# Altium project PCB Issues.PrjPcb
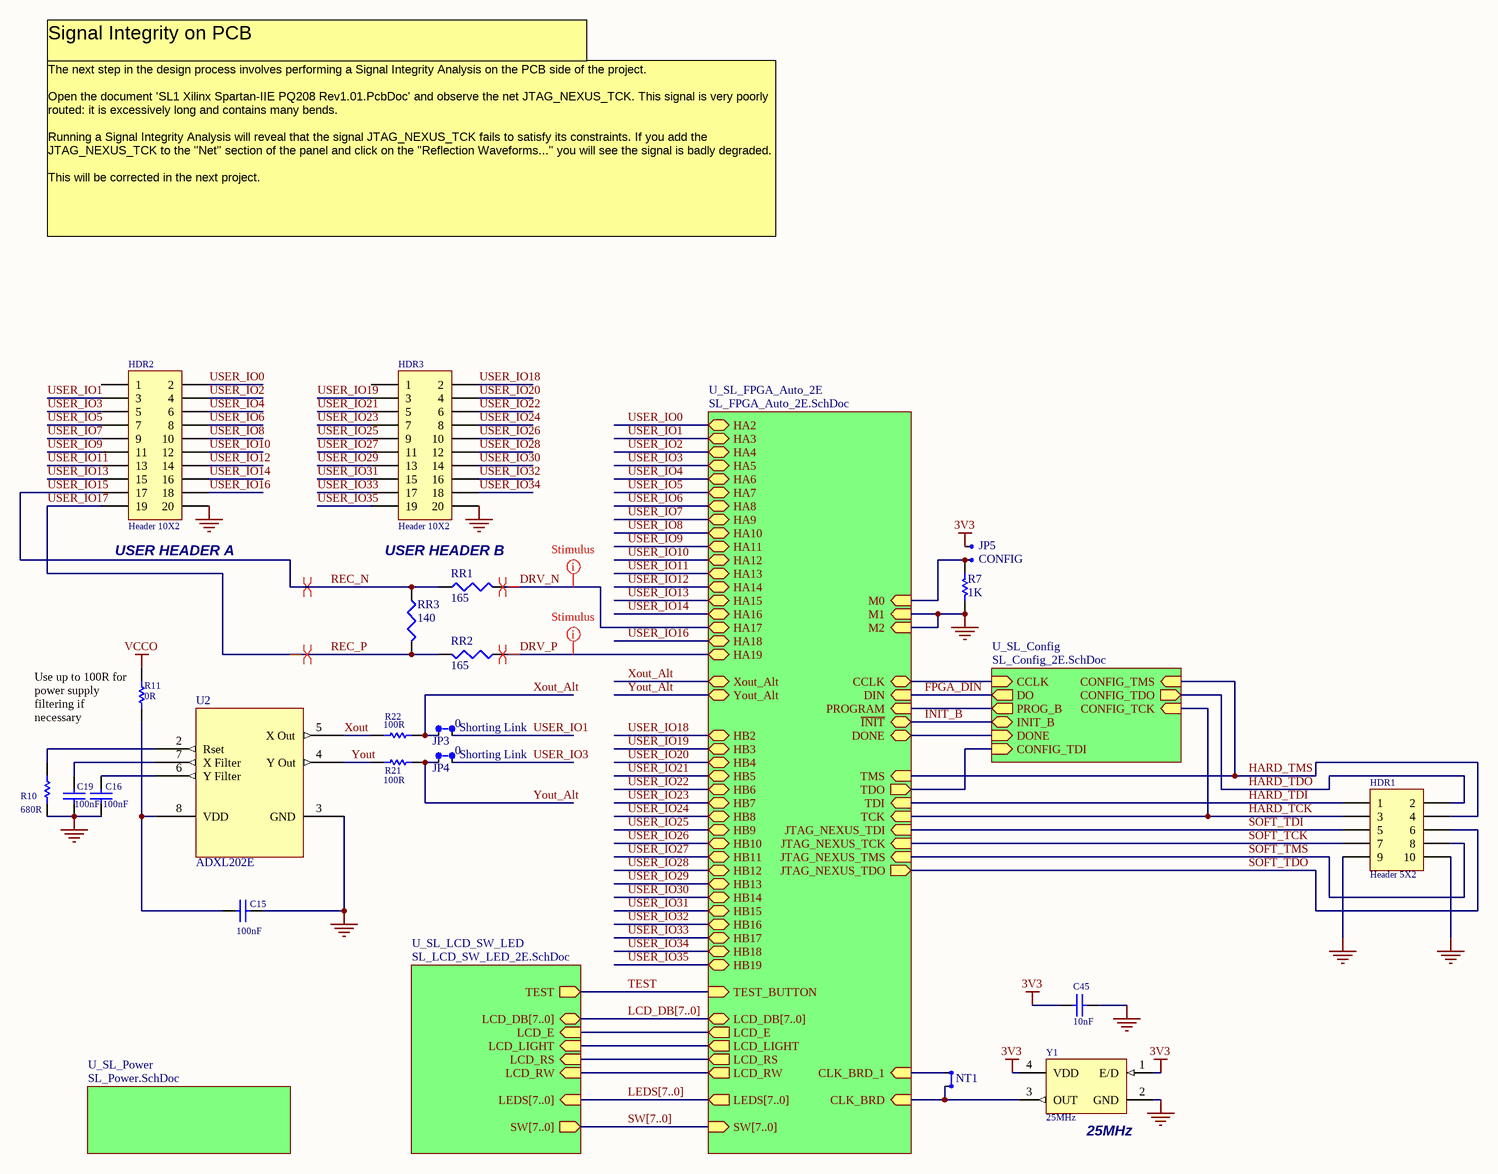
[diagram p0: SL1 Xilinx Spartan-IIE PQ208 Rev1.01.SchDoc]
3 sheets, 91 parts. Net scope: hierarchical (ports join the sheet entries above them; power ports are global).
Board file: SL1 Xilinx Spartan-IIE PQ208 Rev1.01.PcbDoc
Sheets:
  SL1 Xilinx Spartan-IIE PQ208 Rev1.01.SchDoc
    U_SL_Config = SL_Config_2E.SchDoc
    U_SL_Power = SL_Power.SchDoc

## Sheet SL1 Xilinx Spartan-IIE PQ208 Rev1.01.SchDoc: Spirit Level - Spartan 2E
size A3; Organization: Altium Limited; Address1: L3, 12a Rodborough Rd; Address2: Frenchs Forest; Address3: NSW; Address4: Australia 2086; DocumentNumber: 5; SheetNumber: 5; SheetTotal: 5

### Parts
C15  100nF  [CC1608-0603]
C16  100nF  [CC1608-0603]
C19  100nF  [CC1608-0603]
C45  10nF  [CC1608-0603]
HDR1  Header 5X2  [HDR2X5_LP]
HDR2  Header 10X2  [HDR2X10]
HDR3  Header 10X2  [HDR2X10]
JP3  X axis  [HDR1X2]  (value not drawn)
JP4  Y axis  [HDR1X2]  (value not drawn)
JP5  CONFIG  [HDR1X2]
JS2  Shorting Link  value 0  (mechanical)
JS3  Shorting Link  value 0  (mechanical)
NT1  *  [NT]  (value not drawn)  (net tie, no BOM)
R7  1K  [CR2012-0805]
R10  680R  [CR2012-0805]
R11  0R  [CR2012-0805]
R21  100R  [CR2012-0805]
R22  100R  [CR2012-0805]
RR1  value 165  [AXIAL-0.3]  (hidden comment: Comment)
RR2  value 165  [AXIAL-0.3]  (hidden comment: Comment)
RR3  value 140  [AXIAL-0.3]  (hidden comment: Comment)
U2  ADXL202E  [E-8]
Y1  25MHz  [QSMO_4200]

### Sub-sheets
U_SL_Config = SL_Config_2E.SchDoc: PROG_B (out), CONFIG_TDO (out), DO (out), CCLK (in), CONFIG_TDI (in), CONFIG_TCK (in), CONFIG_TMS (in), INIT_B (bidir), DONE (in)
U_SL_FPGA_Auto_2E = SL_FPGA_Auto_2E.SchDoc (file not in this document): CLK_BRD (in), HA10 (bidir), HA11 (bidir), HA12 (bidir), HA13 (bidir), HA14 (bidir), HA15 (bidir), HA16 (bidir), HA17 (bidir), HA18 (bidir), HA19 (bidir), HA2 (bidir), HA3 (bidir), HA4 (bidir), HA5 (bidir), HA6 (bidir), HA7 (bidir), HA8 (bidir), HA9 (bidir), HB10 (bidir), HB11 (bidir), HB12 (bidir), HB13 (bidir), HB14 (bidir), HB15 (bidir), HB16 (bidir), HB17 (bidir), HB18 (bidir), HB19 (bidir), HB2 (bidir), HB3 (bidir), HB4 (bidir), HB5 (bidir), HB6 (bidir), HB7 (bidir), HB8 (bidir), HB9 (bidir), JTAG_NEXUS_TCK (in), JTAG_NEXUS_TDI (in), JTAG_NEXUS_TDO (out), JTAG_NEXUS_TMS (in), LCD_DB[7..0] (bidir), LCD_E (out), LCD_LIGHT (out), LCD_RS (out), LCD_RW (out), LEDS[7..0] (out), SW[7..0] (in), TEST_BUTTON (in), CCLK (bidir), DONE (bidir), M0 (in), M1 (in), M2 (in), PROGRAM (in), TCK (in), TDI (in), TDO (out), TMS (in), DIN (in), ~{INIT} (bidir), CLK_BRD_1 (in), Xout_Alt, Yout_Alt
U_SL_LCD_SW_LED = SL_LCD_SW_LED_2E.SchDoc (file not in this document): TEST (out), SW[7..0] (out), LCD_DB[7..0] (bidir), LCD_E (in), LCD_RS (in), LCD_RW (in), LCD_LIGHT (in), LEDS[7..0] (in)
U_SL_Power = SL_Power.SchDoc: no entries

### Nets
3V3: C45.1 JP5.2 R11.1 Y1.1(E/D) Y1.4(VDD)  [also labelled VCCO]
GND: C15.2 C16.2 C19.2 C45.2 HDR1.9 HDR1.10 HDR2.20 HDR3.20 R7.1 R10.1 U2.3(GND) Y1.2(GND) ; sheet U_SL_FPGA_Auto_2E/M1, sheet U_SL_FPGA_Auto_2E/M2
CCLK: sheet U_SL_Config/CCLK, sheet U_SL_FPGA_Auto_2E/CCLK
DONE: sheet U_SL_Config/DONE, sheet U_SL_FPGA_Auto_2E/DONE
DRV_N: RR1.1 ; sheet U_SL_FPGA_Auto_2E/HA17
DRV_P: RR2.2 ; sheet U_SL_FPGA_Auto_2E/HA19
FPGA_DIN: sheet U_SL_Config/DO, sheet U_SL_FPGA_Auto_2E/DIN  [project net DO]
HARD_TCK: HDR1.3 ; sheet U_SL_Config/CONFIG_TCK, sheet U_SL_FPGA_Auto_2E/TCK
HARD_TDI: HDR1.1 ; sheet U_SL_FPGA_Auto_2E/TDI
HARD_TDO: HDR1.2 ; sheet U_SL_Config/CONFIG_TDO
HARD_TMS: HDR1.4 ; sheet U_SL_Config/CONFIG_TMS, sheet U_SL_FPGA_Auto_2E/TMS
INIT_B: sheet U_SL_Config/INIT_B, sheet U_SL_FPGA_Auto_2E/~{INIT}
PROG_B: sheet U_SL_Config/PROG_B, sheet U_SL_FPGA_Auto_2E/PROGRAM
REC_N: HDR2.17 RR1.2 RR3.2  [also labelled USER_IO15]
REC_P: HDR2.19 RR2.1 RR3.1  [also labelled USER_IO17]
SOFT_TCK: HDR1.7 ; sheet U_SL_FPGA_Auto_2E/JTAG_NEXUS_TCK
SOFT_TDI: HDR1.5 ; sheet U_SL_FPGA_Auto_2E/JTAG_NEXUS_TDI
SOFT_TDO: HDR1.6 ; sheet U_SL_FPGA_Auto_2E/JTAG_NEXUS_TDO
SOFT_TMS: HDR1.8 ; sheet U_SL_FPGA_Auto_2E/JTAG_NEXUS_TMS
TDI_C: sheet U_SL_Config/CONFIG_TDI, sheet U_SL_FPGA_Auto_2E/TDO
TEST: sheet U_SL_LCD_SW_LED/TEST, sheet U_SL_FPGA_Auto_2E/TEST_BUTTON
USER_IO0: HDR2.2 ; sheet U_SL_FPGA_Auto_2E/HA2
USER_IO1: HDR2.3 JP3.2 ; sheet U_SL_FPGA_Auto_2E/HA3
USER_IO2: HDR2.4 ; sheet U_SL_FPGA_Auto_2E/HA4
USER_IO3: HDR2.5 JP4.2 ; sheet U_SL_FPGA_Auto_2E/HA5
USER_IO4: HDR2.6 ; sheet U_SL_FPGA_Auto_2E/HA6
USER_IO5: HDR2.7 ; sheet U_SL_FPGA_Auto_2E/HA7
USER_IO6: HDR2.8 ; sheet U_SL_FPGA_Auto_2E/HA8
USER_IO7: HDR2.9 ; sheet U_SL_FPGA_Auto_2E/HA9
USER_IO8: HDR2.10 ; sheet U_SL_FPGA_Auto_2E/HA10
USER_IO9: HDR2.11 ; sheet U_SL_FPGA_Auto_2E/HA11
USER_IO10: HDR2.12 ; sheet U_SL_FPGA_Auto_2E/HA12
USER_IO11: HDR2.13 ; sheet U_SL_FPGA_Auto_2E/HA13
USER_IO12: HDR2.14 ; sheet U_SL_FPGA_Auto_2E/HA14
USER_IO13: HDR2.15 ; sheet U_SL_FPGA_Auto_2E/HA15
USER_IO14: HDR2.16 ; sheet U_SL_FPGA_Auto_2E/HA16
USER_IO16: HDR2.18 ; sheet U_SL_FPGA_Auto_2E/HA18
USER_IO18: HDR3.2 ; sheet U_SL_FPGA_Auto_2E/HB2
USER_IO19: HDR3.3 ; sheet U_SL_FPGA_Auto_2E/HB3
USER_IO20: HDR3.4 ; sheet U_SL_FPGA_Auto_2E/HB4
USER_IO21: HDR3.5 ; sheet U_SL_FPGA_Auto_2E/HB5
USER_IO22: HDR3.6 ; sheet U_SL_FPGA_Auto_2E/HB6
USER_IO23: HDR3.7 ; sheet U_SL_FPGA_Auto_2E/HB7
USER_IO24: HDR3.8 ; sheet U_SL_FPGA_Auto_2E/HB8
USER_IO25: HDR3.9 ; sheet U_SL_FPGA_Auto_2E/HB9
USER_IO26: HDR3.10 ; sheet U_SL_FPGA_Auto_2E/HB10
USER_IO27: HDR3.11 ; sheet U_SL_FPGA_Auto_2E/HB11
USER_IO28: HDR3.12 ; sheet U_SL_FPGA_Auto_2E/HB12
USER_IO29: HDR3.13 ; sheet U_SL_FPGA_Auto_2E/HB13
USER_IO30: HDR3.14 ; sheet U_SL_FPGA_Auto_2E/HB14
USER_IO31: HDR3.15 ; sheet U_SL_FPGA_Auto_2E/HB15
USER_IO32: HDR3.16 ; sheet U_SL_FPGA_Auto_2E/HB16
USER_IO33: HDR3.17 ; sheet U_SL_FPGA_Auto_2E/HB17
USER_IO34: HDR3.18 ; sheet U_SL_FPGA_Auto_2E/HB18
USER_IO35: HDR3.19 ; sheet U_SL_FPGA_Auto_2E/HB19
Xout: R22.2 U2.5(X_Out)
Xout_Alt: JP3.1 R22.1 ; sheet U_SL_FPGA_Auto_2E/Xout_Alt
Yout: R21.2 U2.4(Y_Out)
Yout_Alt: JP4.1 R21.1 ; sheet U_SL_FPGA_Auto_2E/Yout_Alt
NetC15_1: C15.1 R11.2 U2.8(VDD)
NetC16_1: C16.1 U2.6(Y_Filter)
NetC19_1: C19.1 U2.7(X_Filter)
NetJP5_1: JP5.1 R7.2 ; sheet U_SL_FPGA_Auto_2E/M0
NetNT1_1: NT1.1 ; sheet U_SL_FPGA_Auto_2E/CLK_BRD_1
NetNT1_2: NT1.2 Y1.3(OUT) ; sheet U_SL_FPGA_Auto_2E/CLK_BRD
NetR10_2: R10.2 U2.2(Rset)
(unnamed): sheet U_SL_LCD_SW_LED/LCD_E, sheet U_SL_FPGA_Auto_2E/LCD_E
(unnamed): sheet U_SL_LCD_SW_LED/LCD_RS, sheet U_SL_FPGA_Auto_2E/LCD_RS
(unnamed): sheet U_SL_LCD_SW_LED/LCD_RW, sheet U_SL_FPGA_Auto_2E/LCD_RW
(unnamed): sheet U_SL_LCD_SW_LED/LCD_LIGHT, sheet U_SL_FPGA_Auto_2E/LCD_LIGHT

Not connected (* = marked no-connect by the designer): HDR2 1; HDR3 1; U2 1(Self_Test)

### Buses and harness runs
bus LCD_DB[7..0] = sheet U_SL_FPGA_Auto_2E/LCD_DB[7..0] = sheet U_SL_LCD_SW_LED/LCD_DB[7..0]
bus LEDS[7..0] = sheet U_SL_FPGA_Auto_2E/LEDS[7..0] = sheet U_SL_LCD_SW_LED/LEDS[7..0]
bus SW[7..0] = sheet U_SL_FPGA_Auto_2E/SW[7..0] = sheet U_SL_LCD_SW_LED/SW[7..0]

### Layout directives
differential pair: DRV_N, DRV_P, REC_N, REC_P
rule Signal Stimulus [Kind - Single Pulse    Level - High    Start Time = 10.00n    Stop Time = 60.00n    Period Time = 100.0n]: DRV_N
rule Signal Stimulus [Kind - Single Pulse    Level - Low    Start Time = 10.00n    Stop Time = 60.00n    Period Time = 100.0n]: DRV_P

### Notes on the sheet
- Signal Integrity on PCB
- The next step in the design process involves performing a Signal Integrity Analysis on the PCB side of the project.
  Open the document 'SL1 Xilinx Spartan-IIE PQ208 Rev1.01.PcbDoc' and observe the net JTAG_NEXUS_TCK. This signal is very poorly routed: it is excessively long and contains many bends.
  Running a Signal Integrity Analysis will reveal that the signal JTAG_NEXUS_TCK fails to satisfy its constraints. If you add the JTAG_NEXUS_TCK to the "Net" section of the panel and click on the "Reflection Waveforms..." you will see the signal is badly degraded.
  This will be corrected in the next project.
- (near HDR2) USER HEADER A
- USER HEADER B
- (near R11) Use up to 100R for power supply filtering if necessary
- (near Y1) 25MHz
- Title
- Size:
- Date:
- A3
- Number:
- Time:
- Revision:
- Sheet
- of
- File:

### Library data of the parts
C15 C16 C19 = CAP: Capacitor; AEMS Code: 2101550
C45 = CAP: Capacitor; AEMS Code: 2100341
HDR1 = Header 5X2: Header, 5-Pin, Dual row; Revision: 17-Jul-2002: Re-released for DXP Platform.
HDR2 HDR3 = Header 10X2: Header, 10-Pin, Dual row; Revision: July-2002: Re-released for DXP Platform.
JP3-JP5 NT1 = Jumper, 2-Pin
JS2 JS3 = Jumper Socket: Shorting Link, 2.54mm (0.1") Pitch
R7 = RES: Resistor; AEMS Code: 1200008JN
R10 = Res1: Resistor; AEMS Code: CHANGED VALUE; Revision: July-2002: Re-released for DXP Platform.
R11 = RES: Resistor; AEMS Code: 1200075
R21 R22 = Res1: Resistor; AEMS Code: 1200012JT; Revision: July-2002: Re-released for DXP Platform.
RR1-RR3 = Res3: Resistor; Published: 8-Jun-2000; LatestRevisionDate: 04-Mar-2005; LatestRevisionNote: PCB Footprint replaced.; PackageReference: J1-0603; Publisher: Altium Limited
U2 = ADXL202E: Accelerometer with Digital Output
Y1 = QSMO_4200: Surface Mount Crystal Oscillator

## Sheet SL_Config_2E.SchDoc: FPGA Configuration
size A; Organization: Altium Limited; Address1: L3, 12a Rodborough Rd; Address2: Frenchs Forest; Address3: NSW; Address4: Australia 2086; DocumentNumber: 2; SheetNumber: 2; SheetTotal: 5
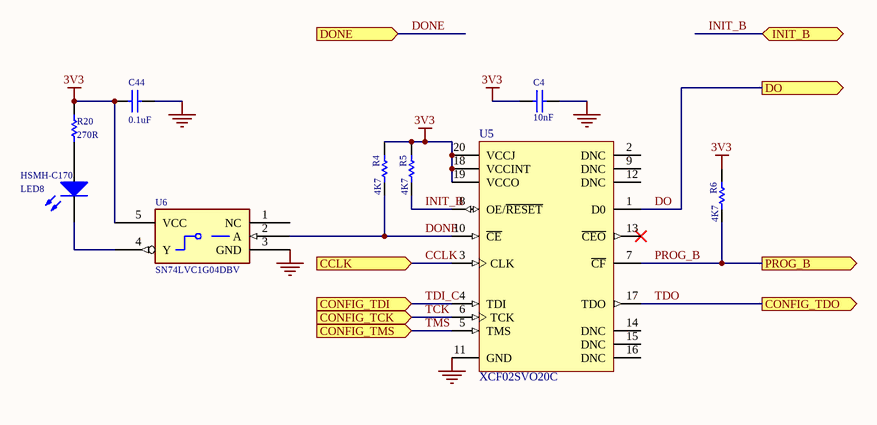
[diagram p1: SL_Config_2E.SchDoc]

### Parts
C4  10nF  [CC1608-0603]
C44  0.1uF  [CC2012-0805]
LED8  HSMH-C170  [SMD _LED]
R4  4K7  [CR2012-0805]
R5  4K7  [CR2012-0805]
R6  4K7  [CR2012-0805]
R20  270R  [CR2012-0805]
U5  XCF02SVO20C  [VO20]
U6  SN74LVC1G04DBV  [SO-G5/P.95]

### Ports
CCLK (in), CONFIG_TCK (in), CONFIG_TDI (in), CONFIG_TDO (out), CONFIG_TMS (in), DO (out), DONE (in), INIT_B (bidir), PROG_B (out)

### Nets
3V3: C4.1 C44.2 R4.1 R5.1 R6.1 R20.2 U5.18(VCCINT) U5.19(VCCO) U5.20(VCCJ) U6.5(VCC)
GND: C4.2 C44.1 U5.11(GND) U6.3(GND)
CCLK: U5.3(CLK) ; port CCLK
DO: U5.1(D0) ; port DO
DONE: R4.2 U5.10(~{CE}) U6.2(A) ; port DONE
INIT_B: R5.2 U5.8(OE/~{RESET}) ; port INIT_B
PROG_B: R6.2 U5.7(~{CF}) ; port PROG_B
TCK: U5.6(TCK) ; port CONFIG_TCK  [project net HARD_TCK]
TDI_C: U5.4(TDI) ; port CONFIG_TDI
TDO: U5.17(TDO) ; port CONFIG_TDO  [project net HARD_TDO]
TMS: U5.5(TMS) ; port CONFIG_TMS  [project net HARD_TMS]
NetLED8_1: LED8.1(A) R20.1
NetLED8_2: LED8.2(K) U6.4(Y)

Not connected (* = marked no-connect by the designer): U5 2(DNC) 9(DNC) 12(DNC) 13(~{CEO})* 14(DNC) 15(DNC) 16(DNC); U6 1(NC)

### Notes on the sheet
- Title
- Size:
- Date:
- A
- Number:
- Time:
- Revision:
- Sheet
- of
- File:

### Library data of the parts
C4 = CAP: Capacitor; AEMS Code: 2100341
C44 = CAP: Capacitor; Supplier: FARNELL; Supplier Code: 317-287
LED8 = HSMX-C670: Typical RED GaAs SMD LED Agilent make; AEMS Code: 2610081; Revision: July-2002: Re-released for DXP Platform.
R4-R6 = RES: Resistor; AEMS Code: 1200226
R20 = RES: Resistor; AEMS Code: 1200430
U5 = XCF02SVO20C: XCF00S Series, Platform Flash In-System Programmable Configuration 3.3V PROM, 20-Pin TSOP, 2-Megabit, Commercial Grade; PackageDocument: ver1.0, May-2003; AEMS Code: CHANGED VALUE; DatasheetDocument: ver2.3, May-2004; PackageReference: VO20; Code_JEDEC: MO-153-AC
U6 = SN74AHC1G04DBVR: Manufacturer: TI

## Sheet SL_Power.SchDoc: Power Supply
size B; Organization: Altium Limited; Address1: L3, 12a Rodborough Rd; Address2: Frenchs Forest; Address3: NSW; Address4: Australia 2086; DocumentNumber: 4; SheetNumber: 4; SheetTotal: 5
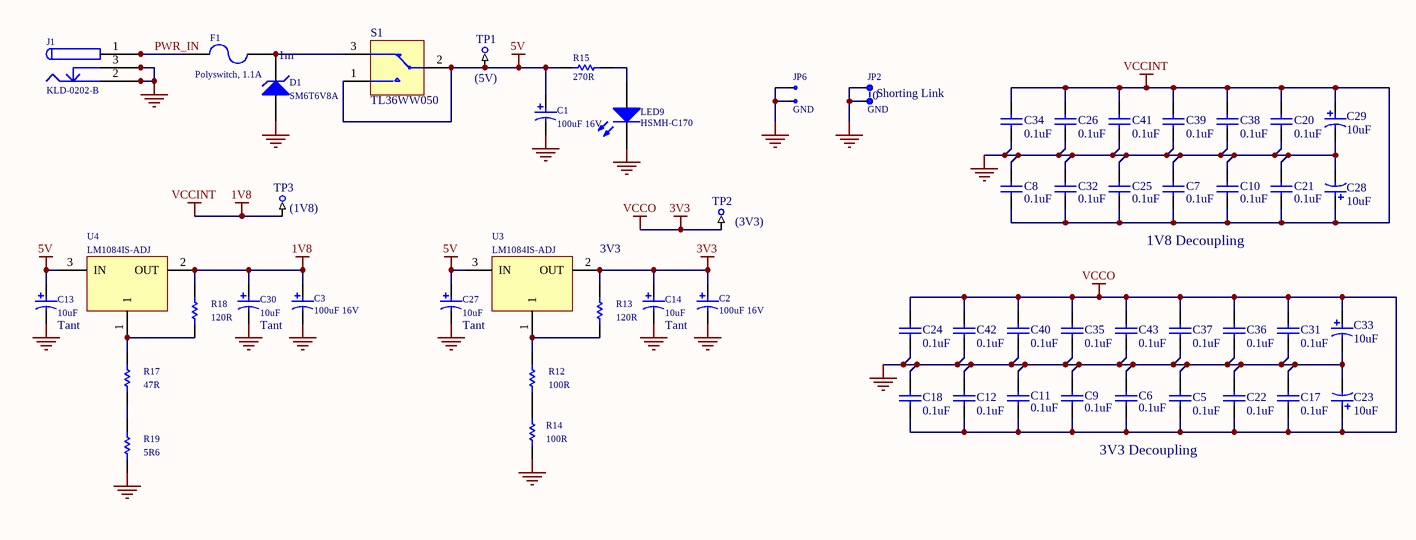
[diagram p2: SL_Power.SchDoc]

### Parts
C1  100uF 16V  [CAPPR2-5x6.8]
C2  100uF 16V  [CAPPR2-5x6.8]
C3  100uF 16V  [CAPPR2-5x6.8]
C5  0.1uF  [CC2012-0805]
C6  0.1uF  [CC2012-0805]
C7  0.1uF  [CC2012-0805]
C8  0.1uF  [CC2012-0805]
C9  0.1uF  [CC2012-0805]
C10  0.1uF  [CC2012-0805]
C11  0.1uF  [CC2012-0805]
C12  0.1uF  [CC2012-0805]
C13  10uF  Capacitor Type: Tant  [MCCT-B]
C14  10uF  Capacitor Type: Tant  [MCCT-B]
C17  0.1uF  [CC2012-0805]
C18  0.1uF  [CC2012-0805]
C20  0.1uF  [CC2012-0805]
C21  0.1uF  [CC2012-0805]
C22  0.1uF  [CC2012-0805]
C23  10uF  [MCCT-B]
C24  0.1uF  [CC2012-0805]
C25  0.1uF  [CC2012-0805]
C26  0.1uF  [CC2012-0805]
C27  10uF  Capacitor Type: Tant  [MCCT-B]
C28  10uF  [MCCT-B]
C29  10uF  [MCCT-B]
C30  10uF  Capacitor Type: Tant  [MCCT-B]
C31  0.1uF  [CC2012-0805]
C32  0.1uF  [CC2012-0805]
C33  10uF  [MCCT-B]
C34  0.1uF  [CC2012-0805]
C35  0.1uF  [CC2012-0805]
C36  0.1uF  [CC2012-0805]
C37  0.1uF  [CC2012-0805]
C38  0.1uF  [CC2012-0805]
C39  0.1uF  [CC2012-0805]
C40  0.1uF  [CC2012-0805]
C41  0.1uF  [CC2012-0805]
C42  0.1uF  [CC2012-0805]
C43  0.1uF  [CC2012-0805]
D1  SM6T6V8A  [DO214]
F1  Polyswitch, 1.1A  value 1m  [RUE160_0.2]
J1  KLD-0202-B  [KLD-0202]
JP2  GND  [HDR1X2]
JP6  GND  [HDR1X2]
JS1  Shorting Link  value 0  (mechanical)
LED9  HSMH-C170  [SMD _LED]
R12  100R  [CC2012-0805]
R13  120R  [CC2012-0805]
R14  100R  [CC2012-0805]
R15  270R  [CR2012-0805]
R17  47R  [CC2012-0805]
R18  120R  [CC2012-0805]
R19  5R6  [CC2012-0805]
S1  TL36WW050  [PCB_SWITCH]
TP1  (5V)  [TP]  (no BOM)
TP2  (3V3)  [TP]  (no BOM)
TP3  (1V8)  [TP]  (no BOM)
U3  LM1084IS-ADJ  [TO-263]
U4  LM1084IS-ADJ  [TO-263]

### Nets
1V8: C3.1 C7.1 C8.1 C10.1 C20.1 C21.1 C25.1 C26.1 C28.1 C29.1 C30.1 C32.1 C34.2 C38.1 C39.1 C41.1 R18.1 TP3.1 U4.2(OUT)  [also labelled VCCINT]
3V3: C2.1 C5.2 C6.1 C9.1 C11.1 C12.1 C14.1 C17.2 C18.2 C22.2 C23.1 C24.2 C31.1 C33.1 C35.1 C36.2 C37.1 C40.1 C42.1 C43.1 R13.1 TP2.1 U3.2(OUT)  [also labelled VCCO]
5V: C1.1 C13.1 C27.1 R15.2 S1.1 S1.2 TP1.1 U3.3(IN) U4.3(IN)
GND: C1.2 C2.2 C3.2 C5.1 C6.2 C7.2 C8.2 C9.2 C10.2 C11.2 C12.2 C13.2 C14.2 C17.1 C18.1 C20.2 C21.2 C22.1 C23.2 C24.1 C25.2 C26.2 C27.2 C28.2 C29.2 C30.2 C31.2 C32.2 C33.2 C34.1 C35.2 C36.1 C37.2 C38.2 C39.2 C40.2 C41.2 C42.2 C43.2 D1.1(A) J1.2 J1.2A J1.2B J1.3 J1.3A J1.3B JP2.1 JP2.2 JP6.1 JP6.2 LED9.2(K) R14.1 R19.2
PWR_IN: F1.1 J1.1 J1.1A J1.1B
NetD1_2: D1.2(K) F1.2 S1.3
NetLED9_1: LED9.1(A) R15.1
NetR12_1: R12.1 R13.2 U3.1
NetR12_2: R12.2 R14.2
NetR17_1: R17.1 R18.2 U4.1
NetR17_2: R17.2 R19.1

### Notes on the sheet
- 3V3
- 1V8 Decoupling
- 3V3 Decoupling
- Title
- Size:
- Date:
- B
- Number:
- Time:
- Revision:
- Sheet
- of
- File:

### Library data of the parts
C1-C3 = CAP_POLAR: Polar Capacitor
C5-C12 C17 C18 C20-C22 C24-C26 C31 C32 C34-C43 = CAP: Capacitor; Supplier: FARNELL; Supplier Code: 317-287
C13 C14 C23 C27-C30 C33 = CAP_POLAR: Polar Capacitor; AEMS Code: 2100110; Supplier: FARNELL; Supplier Code: 967-117
D1 = BZG03C13: Zener Diode, 6.2V, 5W; Manufacturer: Microsemi; Revision: 31-Oct-2003
F1 = Fuse 2: Polyswitch 1.1A, Raychem RUE110; Revision: July-2002: Re-released for DXP Platform.; Supplier: FARNELL; Supplier Code: 608-907
J1 = KLD-0202-B: Low Voltage Power Supply Connector; Manufacturer: Kycon; AEMS Code: 3510211
JP2 JP6 = Jumper, 2-Pin
JS1 = Jumper Socket: Shorting Link, 2.54mm (0.1") Pitch
LED9 = HSMX-C670: as LED8 on sheet SL_Config_2E; Revision: July-2002: Re-released for DXP Platform.
R12 R14 = RES: Resistor; AEMS Code: 1200012JT
R13 R18 = RES: Resistor; AEMS Code: 1200781
R15 = RES: Resistor; AEMS Code: 1200430
R17 = RES: Resistor; AEMS Code: CHANGED VALUE
R19 = RES: Resistor; AEMS Code: 1200069
S1 = PCB_MOUNT_SWITCH: SPDT Subminiature Toggle Switch; Supplier: FARNELL; Supplier Code: 150-559
TP1-TP3 = TestPin
U3 U4 = LM1084IS-ADJ: 5A Low Dropout Possitive Regulators

## Nets that join several sheets
3V3: SL1 Xilinx Spartan-IIE PQ208 Rev1.01 (5 pins), SL_Config_2E (10 pins), SL_Power (23 pins)
GND: SL1 Xilinx Spartan-IIE PQ208 Rev1.01 (12 pins), SL_Config_2E (C4.2 C44.1 U5.11 U6.3), SL_Power (53 pins)
HARD_TCK: SL1 Xilinx Spartan-IIE PQ208 Rev1.01 (HDR1.3), SL_Config_2E (U5.6)
HARD_TDO: SL1 Xilinx Spartan-IIE PQ208 Rev1.01 (HDR1.2), SL_Config_2E (U5.17)
HARD_TMS: SL1 Xilinx Spartan-IIE PQ208 Rev1.01 (HDR1.4), SL_Config_2E (U5.5)